# EAGLE design basic-dual-supply (EAGLE 7.7.0)
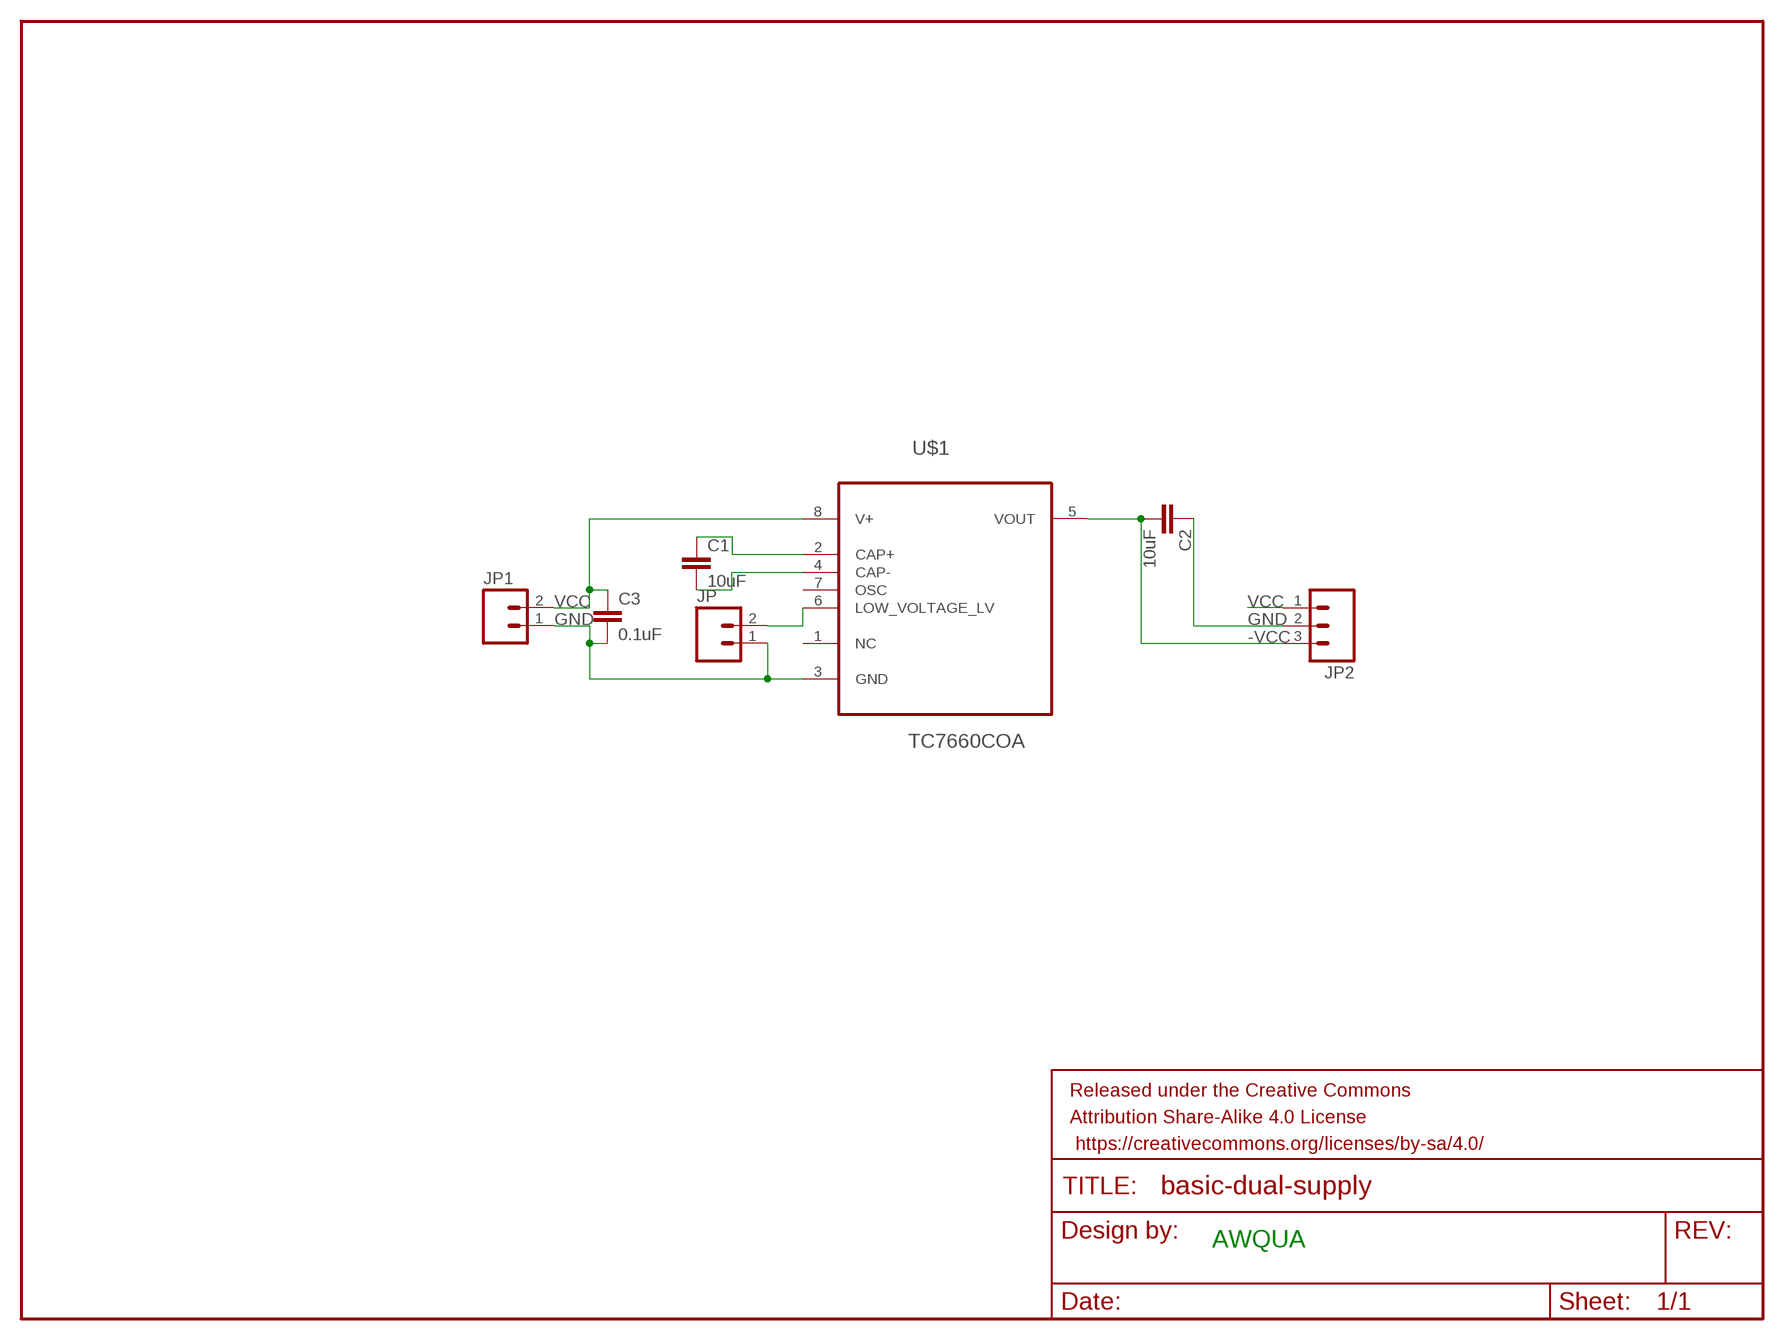
[diagram p0: schematic, sheet 1]

## Parts
C1  10uF  CAP0603-CAP  [0603-CAP]
C2  10uF  CAP0603-CAP  [0603-CAP]
C3  0.1uF  CAP0603-CAP  [0603-CAP]
FRAME1  FRAME-LETTER  [CREATIVE_COMMONS]
JP  M02PTH  [1X02]
JP1  M02PTH  [1X02]
JP2  M03PTH  [1X03]
U$1  TC7660COA  [SOIC127P600X175-8N]

## Nets
-VCC: C2.2 JP2.3 U$1.5(VOUT)
GND: C2.1 C3.2 JP1.1 JP2.2 JP.1 U$1.3(GND)
N$2: C1.1 U$1.2(CAP+)
N$3: C1.2 U$1.4(CAP-)
N$4: JP.2 U$1.6(LOW_VOLTAGE_LV)
VCC: C3.1 JP1.2 JP2.1 U$1.8(V+)
Unconnected: U$1.1(NC) U$1.7(OSC)

## Notes on the sheet
- AWQUA

## Library data of the parts
C1-C3 = SparkFun-Passives:CAP: Capacitor Standard 0603 ceramic capacitor, and 0.1" leaded capacitor.
FRAME1 = SparkFun-Aesthetics:FRAME-LETTER: Schematic Frame Standard 8.5x11 US Letter frame
JP JP1 = SparkFun-Connectors:M02: Standard 2-pin 0.1" header. Use with - straight break away headers ( PRT-00116) - right angle break away headers (PRT-00553) - swiss pins (PRT-00743) - machine pins (PRT-00117) - female headers (PRT-00115) Molex polarized connector foot print use with: PRT-08233 with associated crimp pins and housings. 2.54_SCREWTERM for use with PRT-10571. 3.5mm Screw Terminal footprints for PRT-08084 5mm Screw Terminal footprints for use with PRT-08432
JP2 = SparkFun-Connectors:M03: Header 3 Standard 3-pin 0.1" header. Use with straight break away headers (SKU : PRT-00116), right angle break away headers (PRT-00553), swiss pins (PRT-00743), machine pins (PRT-00117), and female headers (PRT-00115). Molex polarized connector foot print use with SKU : PRT-08232 with associated crimp pins and housings.
U$1 = TC7660COA:TC7660COA: DC-to-DC Voltage Converter; AVAILABILITY: Good; DESCRIPTION: Converters - DC/DC - Charge Pump - Inverters and Doublers - 20-45mA DC-DC Converter; MF: Microchip; MP: TC7660COA; PACKAGE: SOIC-8 Microchip; PRICE: 0.55 USD

## Board
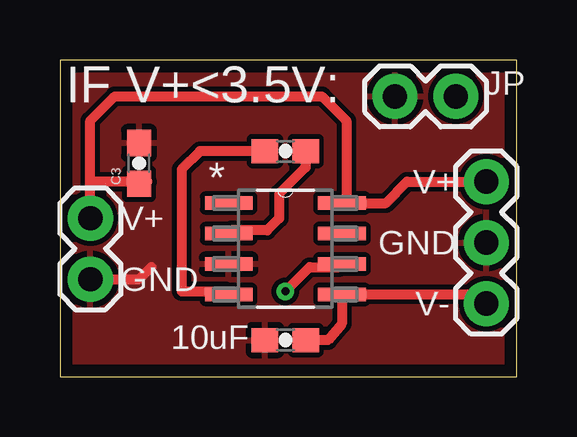
[diagram p1: board, top side]
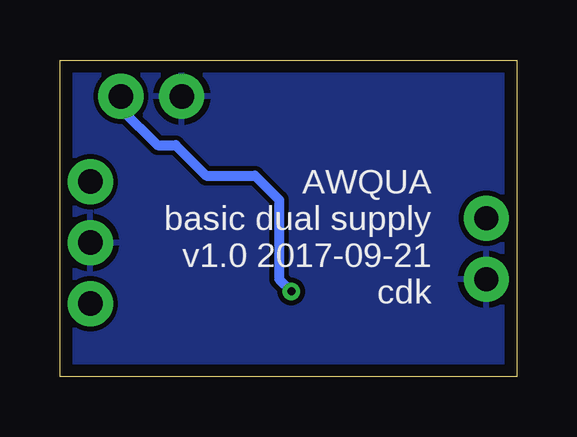
[diagram p2: board, bottom side, seen from below]

Size 19.05 x 13.2 mm. Coordinates in mm from the lower left corner, seen from the top.
Outline: 0,0 19.05,0 19.05,13.2 0,13.2 0,0
Copper layers (1*16): Top 0.035mm / dielectric 1.5mm / Bottom 0.035mm
Design rules "default *": minimum track width 10mil, minimum drill 13mil, track to track 8mil, track to pad 8mil, pad to pad 8mil, via to via 8mil, smd to smd 8mil, copper to edge 20mil, drill to drill 8mil, minimum pad ring 10mil, minimum via ring 8mil, stop-mask expansion 4mil, vias tented up to drill 13mil, thermal gap 10mil

### Footprints (pad centres in the part's own frame; a part is rotated, then mirrored left to right if it is on the bottom)
0603-CAP = smd 1.1 x 1: 1 -0.85,0; 2 0.85,0
1X02 = drill 1.016 pad 1.88: 1 0,0; 2 2.54,0
1X03 = drill 1.016 pad 1.88: 1 0,0; 2 2.54,0; 3 5.08,0
SOIC127P600X175-8N = smd 1.981 x 0.559: 1 -2.362,1.905; 2 -2.362,0.635; 3 -2.362,-0.635; 4 -2.362,-1.905; 5 2.362,-1.905; 6 2.362,-0.635; 7 2.362,0.635; 8 2.362,1.905

### Placement (x,y rotation side)
C1  9.4,9.4 180 top
C2  9.4,1.52 0 top
C3  3.3,8.89 90 top
FRAME1  -1.27,-11.18 0 top  (outside the outline)
JP  13.97,11.68 0 top
JP1  1.27,4.06 90 top
JP2  17.78,8.13 270 top
U$1  9.4,5.33 0 top

### Tracks (layer width: path | path; a pad name or v marks a point on that pad's centre or on a via)
-VCC
  Top 0.406: JP2.3 17.4,3.43 U$1.5 11.76,2.21 11.18,1.52 C2.2
GND
  Top 0.406: JP1.1 3.3,4.06 3.81,4.57
  pour Bottom: -3.81,34.29 44.2,34.04 44.2,-3.81 -4.06,-3.81
  pour Top: -3.05,33.27 44.96,33.02 44.96,-4.83 -3.3,-4.83
N$2
  Top 0.406: C1.1 10.25,8.72 9.14,7.62 9.14,6.6 8.64,6.1 7.16,6.1 U$1.2
N$3
  Top 0.406: C1.2 5.84,9.4 5.08,8.64 5.08,3.56 6.91,3.56 U$1.4
N$4  (via drill 0.33)
  Top 0.406: v9.4,3.56 10.41,4.57 11.63,4.57 U$1.6
  Bottom 0.406: JP.2 16.51,11.18 14.99,9.65 14.22,9.65 12.95,8.38 10.92,8.38 9.91,7.37 9.91,4.06 v9.4,3.56
VCC
  Top 0.406: JP1.2 1.27,8.13 | 1.27,8.13 1.27,10.67 2.29,11.68 10.92,11.68 11.94,10.67 11.94,7.32 U$1.8 13.59,7.24 14.48,8.13 JP2.1 | C3.1 3.64,8.13 1.27,8.13

### Text on the board
tPlace: V+ | V+ | GND | GND | V-
tNames: IF V+<3.5V: | AWQUA
bNames: AWQUA / basic dual supply / v1.0 2017-09-21 / cdk